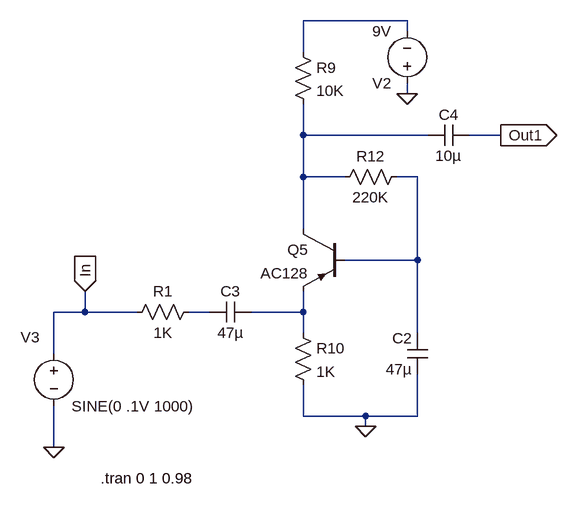
[diagram p0: schematic mixer1transistor.asc]
mixer1transistor.asc, the LTspice schematic file:
Version 4
SHEET 1 1672 680
WIRE 672 -848 512 -848
WIRE 672 -832 672 -848
WIRE 512 -800 512 -848
WIRE 672 -736 672 -752
WIRE 512 -672 512 -720
WIRE 704 -672 512 -672
WIRE 816 -672 768 -672
WIRE 512 -608 512 -672
WIRE 576 -608 512 -608
WIRE 688 -608 656 -608
WIRE 512 -528 512 -608
WIRE 688 -480 688 -608
WIRE 688 -480 576 -480
WIRE 176 -400 176 -432
WIRE 176 -400 128 -400
WIRE 256 -400 176 -400
WIRE 368 -400 336 -400
WIRE 512 -400 512 -432
WIRE 512 -400 432 -400
WIRE 512 -368 512 -400
WIRE 688 -368 688 -480
WIRE 128 -336 128 -400
WIRE 512 -240 512 -288
WIRE 608 -240 512 -240
WIRE 688 -240 688 -304
WIRE 688 -240 608 -240
WIRE 608 -224 608 -240
WIRE 128 -192 128 -256
FLAG 672 -736 0
FLAG 608 -224 0
FLAG 816 -672 Out1
IOPIN 816 -672 Out
FLAG 128 -192 0
FLAG 176 -432 In
IOPIN 176 -432 In
SYMBOL voltage 672 -736 R180
WINDOW 123 0 0 Left 2
WINDOW 39 24 -12 Left 2
SYMATTR InstName V2
SYMATTR Value 9V
SYMBOL pnp 576 -528 M0
SYMATTR InstName Q5
SYMATTR Value AC128
SYMBOL voltage 128 -352 R0
WINDOW 39 -112 95 Left 2
WINDOW 3 27 97 Left 2
WINDOW 0 -51 -9 Left 2
SYMATTR Value SINE(0 .1V 1000)
SYMATTR InstName V3
SYMATTR Value2 AC 1
SYMBOL cap 704 -368 M0
SYMATTR InstName C2
SYMATTR Value 47µ
SYMBOL res 496 -816 R0
SYMATTR InstName R9
SYMATTR Value 10K
SYMBOL res 496 -384 R0
SYMATTR InstName R10
SYMATTR Value 1K
SYMBOL cap 432 -416 R90
WINDOW 0 0 32 VBottom 2
WINDOW 3 32 32 VTop 2
SYMATTR InstName C3
SYMATTR Value 47µ
SYMBOL res 672 -624 R90
WINDOW 0 0 56 VBottom 2
WINDOW 3 32 56 VTop 2
SYMATTR InstName R12
SYMATTR Value 220K
SYMBOL cap 768 -688 R90
WINDOW 0 0 32 VBottom 2
WINDOW 3 32 32 VTop 2
SYMATTR InstName C4
SYMATTR Value 10µ
SYMBOL res 352 -416 R90
WINDOW 0 0 56 VBottom 2
WINDOW 3 32 56 VTop 2
SYMATTR InstName R1
SYMATTR Value 1K
TEXT 200 -144 Left 2 !.tran 0 1 0.98

The netlist it stands for:
* mixer1transistor.asc
V2 0 N001 9V
Q5 N002 N003 N005 0 AC128
V3 In 0 SINE(0 .1V 1000) AC 1
C2 N003 0 47µ
R9 N001 N002 10K
R10 N005 0 1K
C3 N005 N004 47µ
R12 N003 N002 220K
C4 Out1 N002 10µ
R1 N004 In 1K
.model NPN NPN
.model PNP PNP
.lib standard.bjt
.tran 0 1 0.98
.backanno
.end